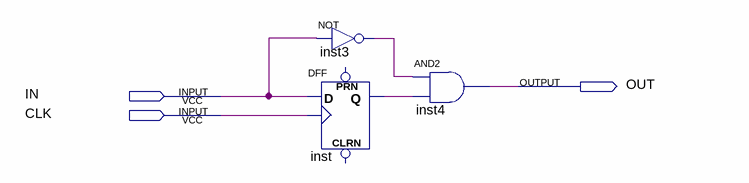
[diagram p0: schematic sheet]
// Quartus schematic FALL_E.bdf as structural Verilog: 3 symbols, 3 pins
module FALL_E (
  input  IN,
  input  CLK,
  output OUT
);

  wire inst3_out, inst_q;

  DFF inst (.CLK(CLK), .D(IN), .Q(inst_q));  // open: CLRN, PRN
  not inst3 (inst3_out, IN);
  and inst4 (OUT, inst3_out, inst_q);
endmodule
